# EasyEDA Pro project OSC1.eprj, schematic 信号调节电路
Create Date: 2024-10-10; Page Name: 三路信号; Project Name: OSC1; Schematic Name: 信号调节电路; Update Date: 2024-10-10; Company: 嘉立创EDA; Page Size: A4; Version: V1.0
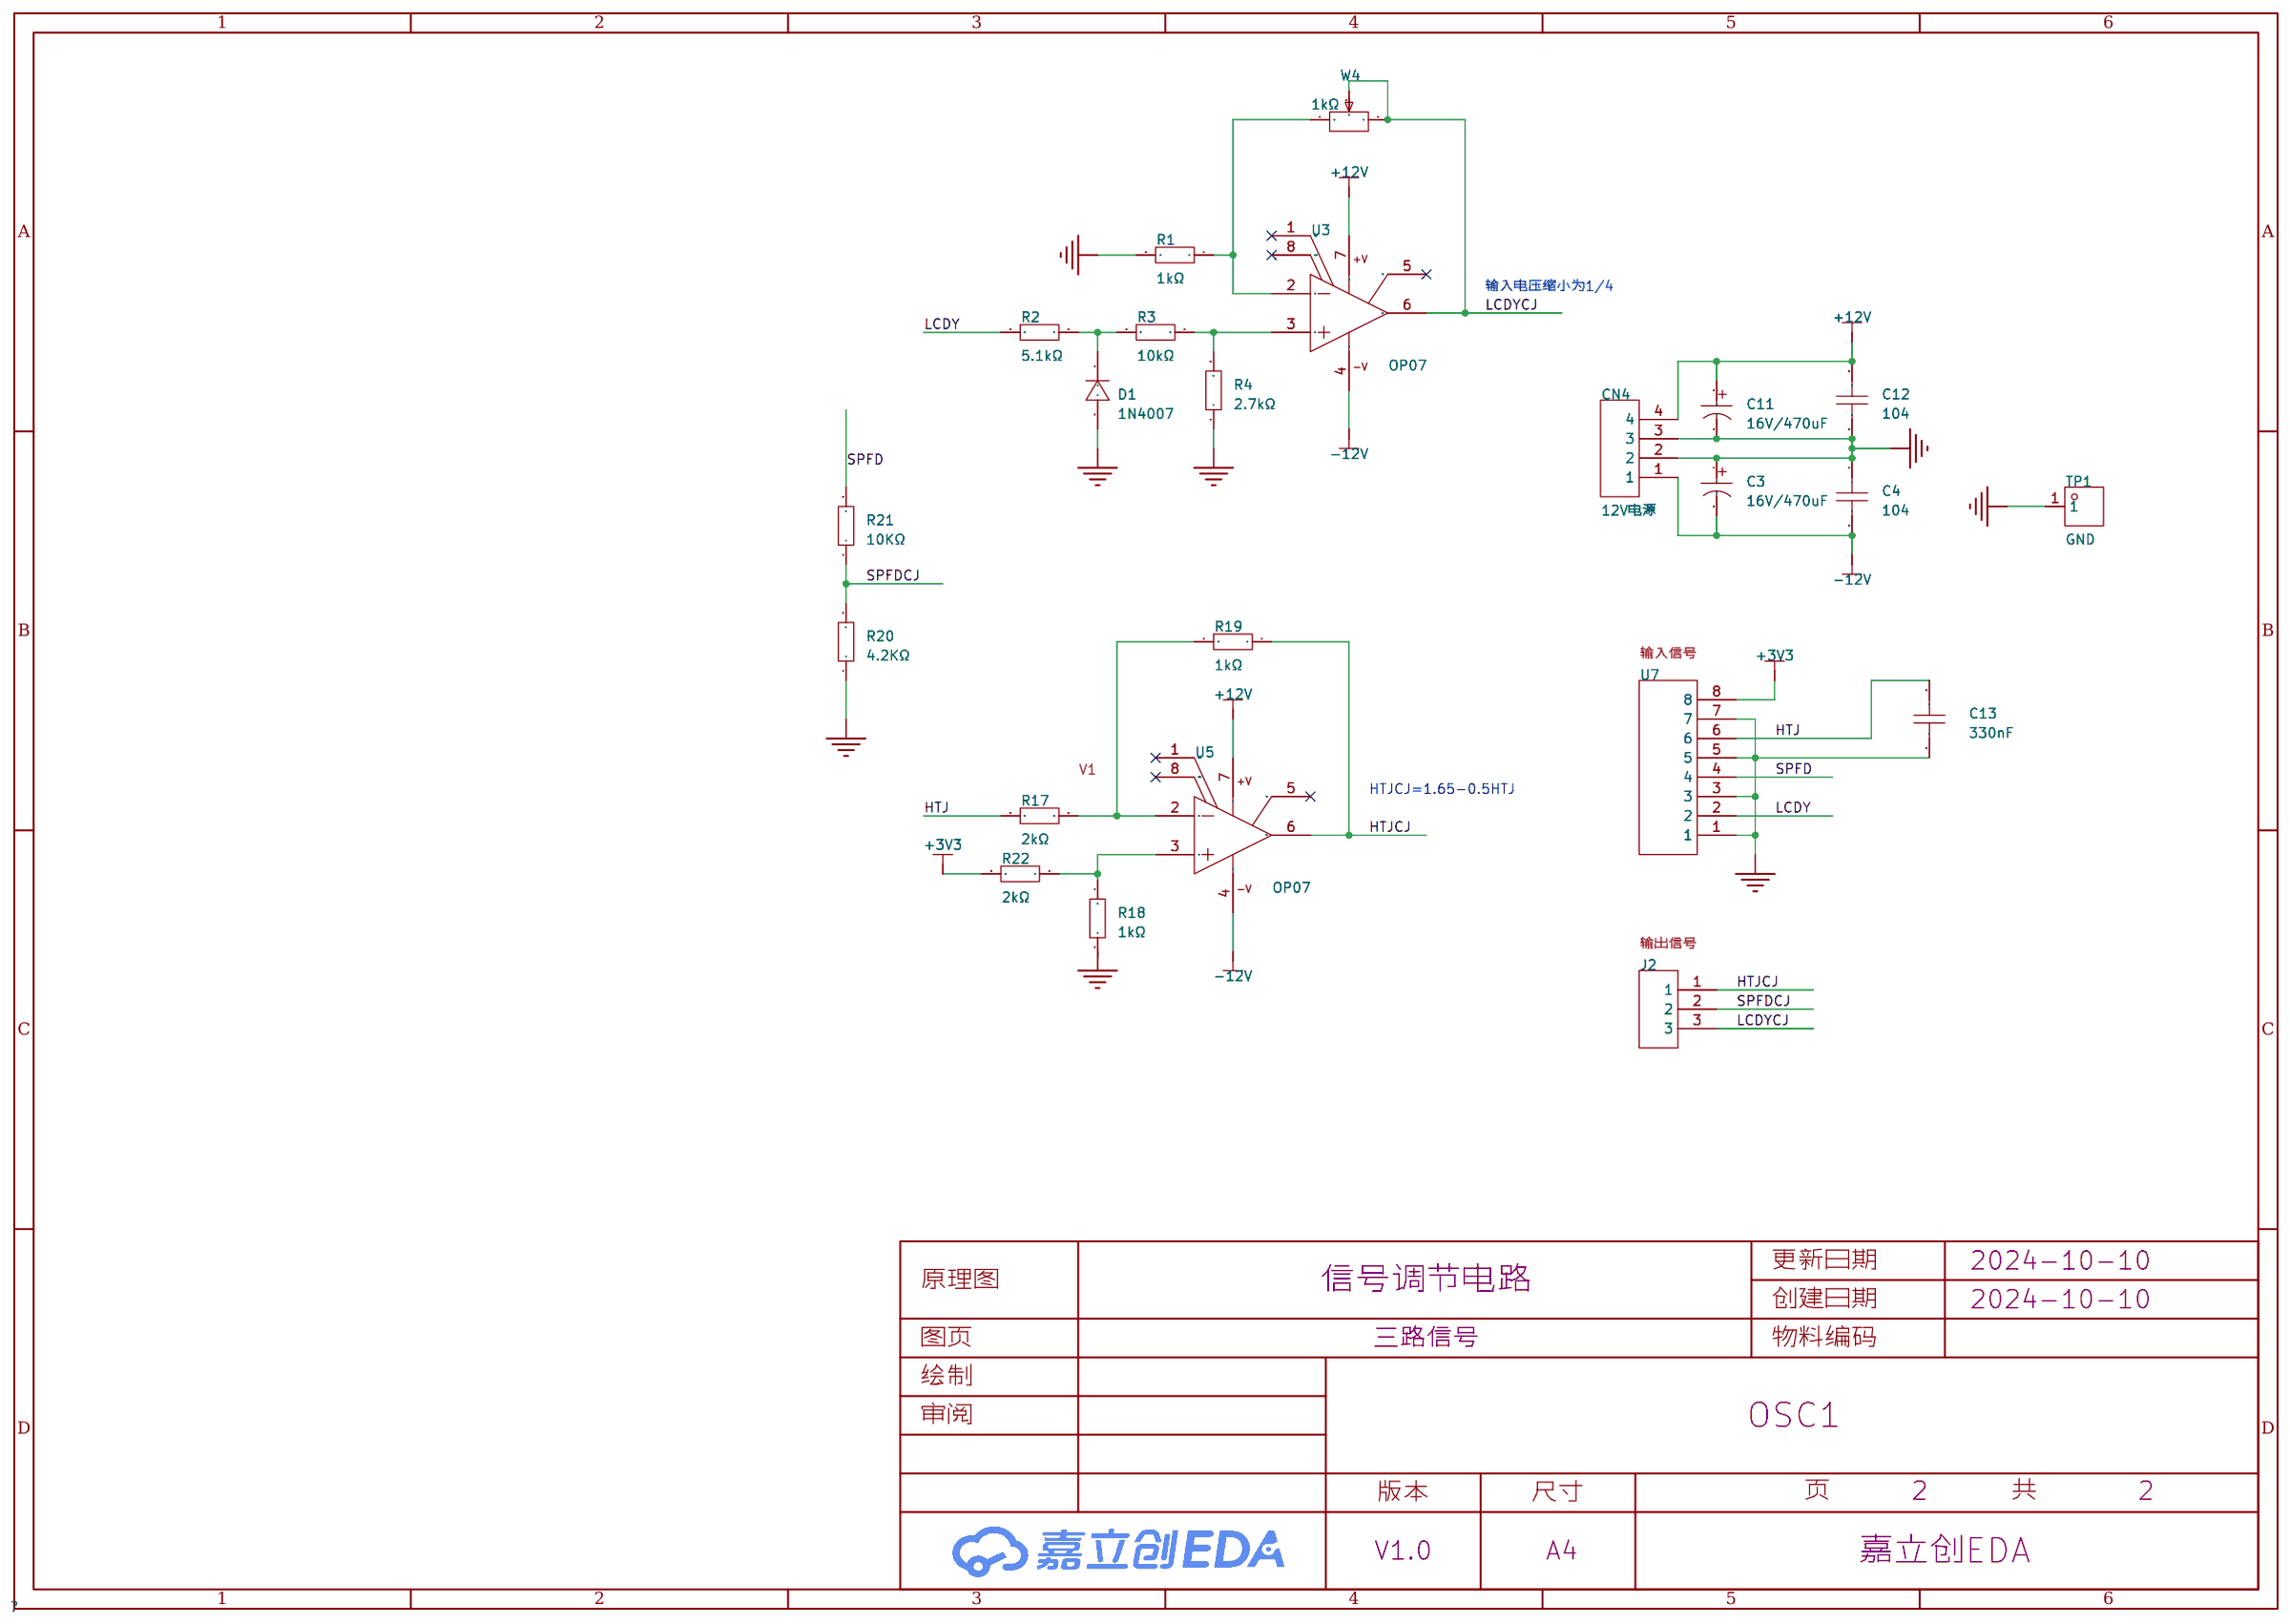
[diagram p6: schematic sheet]

## Parts
C3  16V/470uF  [CAP-TH_BD8.0-P3.50-D0.6-FD]
C4  104  [cap-th_l7.2-w4.0-p5.00-d0.5]
C11  16V/470uF  [CAP-TH_BD8.0-P3.50-D0.6-FD]
C12  104  [cap-th_l7.2-w4.0-p5.00-d0.5]
C13  330nF  [C0603]
CN4  12V电源  [CONN-TH_4P-P2.54_A2510S-4P]
D1  1N4007  [DO-41_BD2.4-L4.7-P8.70-D0.9-RD]
J2  -  [CH2.54-3插座]
R1  1kΩ  [RES-TH_BD2.5-L6.5-P10.50-D0.6]
R2  5.1kΩ  [RES-TH_BD2.5-L6.5-P10.50-D0.6]
R3  10kΩ  [RES-TH_BD2.5-L6.5-P10.50-D0.6]
R4  2.7kΩ  [RES-TH_BD2.5-L6.5-P10.50-D0.6]
R17  2kΩ  [RES-TH_BD2.5-L6.5-P10.50-D0.6]
R18  1kΩ  [RES-TH_BD2.5-L6.5-P10.50-D0.6]
R19  1kΩ  [RES-TH_BD2.5-L6.5-P10.50-D0.6]
R20  4.2KΩ  [240*80mil]
R21  10KΩ  [240*80mil]
R22  2kΩ  [RES-TH_BD2.5-L6.5-P10.50-D0.6]
TP1  GND  [TESTPOINT-TH_BD3.2]
U3  OP07  [DIP-8_L8.8-W6.4-P2.54-LS7.6-BL]
U5  OP07  [DIP-8_L8.8-W6.4-P2.54-LS7.6-BL]
U7  -  [CH2.54-8 插座]
W4  1kΩ  [RES-ADJ-TH_3296W]

## Library data of the parts
C3 C11 = 16V/470uF: 脚间距:3.5mm;电容体直径:8mm;精度:±20%;工作温度:-;额定电压:16V;容值:470uF;工作寿命:2000hrs 105℃;电容体长度:12mm;; Rated Voltage: 16V; Supplier: LCSC; Supplier Part: C28067; Supplier Footprint: 径向引线,8x12mm; JLCPCB Part Class: 扩展库; LCSC Part Name: 470uF 16V; Tolerance: ±20%; Datasheet: https://atta.szlcsc.com/upload/public/pdf/source/20151029/1457707512884.pdf; Manufacturer: CX(承兴); Manufacturer Part: KM477M016F12RR0VH2FP0; L: 12mm; Lead Spacing: 3.5mm; Lifetime @ Temp: 2000hrs 105℃; φD: 8mm
C4 C12 = 104电容: 容值:100nF;精度:±5%;额定电压:100V;工作温度:-40~+105;; LCSC Part Name: 100nF ±5% 100V; Supplier Part: C333827; Manufacturer: HEL鸿志; Manufacturer Part: MES104J2A-7-50R0; Supplier Footprint: 径向引线,P=5mm; JLCPCB Part Class: Extended Part; Datasheet: https://atta.szlcsc.com/upload/public/pdf/source/20190802/C333827_0C3A382E0AFB64319515A56455BE3B3E.pdf; Supplier: LCSC; Tolerance: ±5%; Voltage Rated: 100V; Operating Temperature: -40~+105
C13 = FCC0603B334K500CT: 容值:330nF;精度:±10%;额定电压:50V;材质(温度系数):X7R;; LCSC Part Name: 330nF ±10% 50V; Supplier Part: C7419419; Manufacturer: FOJAN(富捷); Supplier Footprint: 0603; JLCPCB Part Class: 扩展库; Datasheet: https://atta.szlcsc.com/upload/public/pdf/source/20230926/96CBFEAC228090559554C216363F8731.pdf; Supplier: LCSC; Tolerance: ±10%; Voltage Rated: 50V; Temperature Coefficient: X7R
CN4 = 2.54mm4芯插座: 参考系列:-;间距:2.54mm;插针结构:1x4P;排数:1;每排PIN数:4;行距:-;安装方式:-;触头材质:黄铜;; LCSC Part Name: MX2.54 2510系列 插座 1*4P 2.54mm 直针米黄; Supplier Part: C140769; Manufacturer: Ckmtw(灿科盟); Manufacturer Part: W-2510S04P-0000; Supplier Footprint: 插件,P=2.54mm; JLCPCB Part Class: 扩展库; Datasheet: https://atta.szlcsc.com/upload/public/pdf/source/20180423/C140769_E5973268EE8E03CF1A982B681C4FAED0.pdf; Supplier: LCSC; Pitch: 2.54mm; Pins Structure: 1x4P; Number of Rows: 1; Number of PINs Per Row: 4; Contact Material: 黄铜
D1 = 1N4007: Supplier: LCSC; Supplier Part: C402311; Supplier Footprint: DO-41; JLCPCB Part Class: 扩展库; Datasheet: https://atta.szlcsc.com/upload/public/pdf/source/20190705/C402311_D2D67FF606A14042155DA6DAFA20C736.pdf; Manufacturer: LGE(鲁光)
J2 = HDR-3P
R1-R4 R17-R19 R22 = 1/4W电阻: 电阻类型:金属膜电阻;阻值:1kΩ;精度:±1%;功率:250mW;温度系数:±50ppm/℃;; LCSC Part Name: 1kΩ ±1% 250mW; Supplier Part: C57435; Manufacturer: UNI-ROYAL(厚声); Manufacturer Part: MFR0W4F1001A50; Supplier Footprint: 轴向引线; JLCPCB Part Class: Extended Part; Datasheet: https://atta.szlcsc.com/upload/public/pdf/source/20170615/1497511028539.pdf; Supplier: LCSC; Type: 金属膜电阻; Tolerance: ±1%; Power(Watts): 250mW; Temperature Coefficient: ±50ppm/℃
R20 R21 = 插件电阻
TP1 = 测试点: LCSC Part Name: TP-黄色测试点; Supplier Part: C9900007422; Manufacturer Part: TP-黄色测试点; Supplier Footprint: TESTPOINT-TH_BD-2P-P2.00; JLCPCB Part Class: 扩展库; Datasheet: https://atta.szlcsc.comnull; Supplier: LCSC
U3 U5 = OP07: 运放类型:-;放大器组数:-;增益带宽积（GBP）:-;压摆率（SR）:-;电源电压:-;各通道供电电流:-;; LCSC Part Name: 非斩波稳零的双极性(双电源供电)运算放大器集成电路; Supplier Part: C507138; Manufacturer: HGSEMI(华冠); Manufacturer Part: OP07N; Supplier Footprint: DIP-8; JLCPCB Part Class: 扩展库; Datasheet: https://atta.szlcsc.com/upload/public/pdf/source/20211018/477D8740EFCD9B37E17BAFAA0BE9F00A.pdf; Supplier: LCSC
U7 = HDR-8P
W4 = 3296W: 阻值:1kΩ;精度:±10%;温度系数:±100ppm/℃;; LCSC Part Name: 1kΩ ±10%; Supplier Part: C57089; Manufacturer: BOURNS; Manufacturer Part: 3296W-1-102LF; JLCPCB Part Class: Extended Part; Datasheet: https://atta.szlcsc.com/upload/public/pdf/source/20151026/1457707506403.pdf; Supplier: LCSC; Tolerance: ±10%; Temperature Coefficient: ±100ppm/℃

## Nets
+3V3: R22.2 U7.8
+12V: C11.1 C12.1 CN4.4 U3.7(VCC+) U5.7(VCC+)
-12V: C3.2 C4.2 CN4.1 U3.4(VCC-) U5.4(VCC-)
GND: C3.1 C4.1 C11.2 C12.2 C13.1 CN4.2 CN4.3 D1.2 R1.2 R4.1 R18.1 R20.1 TP1.1 U7.1 U7.3 U7.5 U7.7
HTJ: C13.2 R17.2 U7.6
HTJCJ: J2.1 R19.1 U5.6(OUT)
LCDY: R2.2 U7.2
LCDYCJ: J2.3 U3.6(OUT) W4.1 W4.2
SPFD: R21.2 U7.4
SPFDCJ: J2.2 R20.2 R21.1
$2N682: D1.1 R2.1 R3.2
$2N687: R3.1 R4.2 U3.3(IN+)
$2N689: R1.1 U3.2(IN-) W4.3
$2N1428: R17.1 R19.2 U5.2(IN-)
$2N5063: R18.2 R22.1 U5.3(IN+)

Not connected (* = marked no-connect by the designer): U3 1(OFFSET N1)* 5(NC)* 8(OFFSET N2)*; U5 1(OFFSET N1)* 5(NC)* 8(OFFSET N2)*

## Notes on the sheet
- 输入电压缩小为1/4
- 输入信号
- V1
- HTJCJ=1.65-0.5HTJ
- 输出信号
